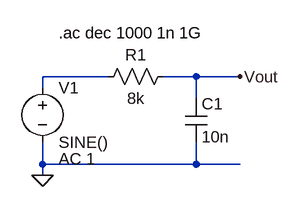
[diagram p0: schematic LPF.asc]
LPF.asc, the LTspice schematic file:
Version 4
SHEET 1 880 680
WIRE 240 96 144 96
WIRE 368 96 320 96
WIRE 432 96 368 96
WIRE 144 112 144 96
WIRE 368 128 368 96
WIRE 144 224 144 192
WIRE 368 224 368 192
WIRE 368 224 144 224
WIRE 432 224 368 224
WIRE 144 240 144 224
FLAG 144 240 0
FLAG 432 96 Vout
SYMBOL res 336 80 R90
WINDOW 0 0 56 VBottom 2
WINDOW 3 32 56 VTop 2
SYMATTR InstName R1
SYMATTR Value 8k
SYMBOL cap 352 128 R0
SYMATTR InstName C1
SYMATTR Value 10n
SYMBOL voltage 144 96 R0
WINDOW 123 24 120 Left 2
WINDOW 39 0 0 Left 0
SYMATTR InstName V1
SYMATTR Value SINE()
SYMATTR Value2 AC 1
TEXT 168 32 Left 2 !.ac dec 1000 1n 1G

The netlist it stands for:
* LPF.asc
R1 Vout N001 8k
C1 Vout 0 10n
V1 N001 0 SINE() AC 1
.ac dec 1000 1n 1G
.backanno
.end